# EasyEDA Pro project ax08.eprj, board debugger_x8
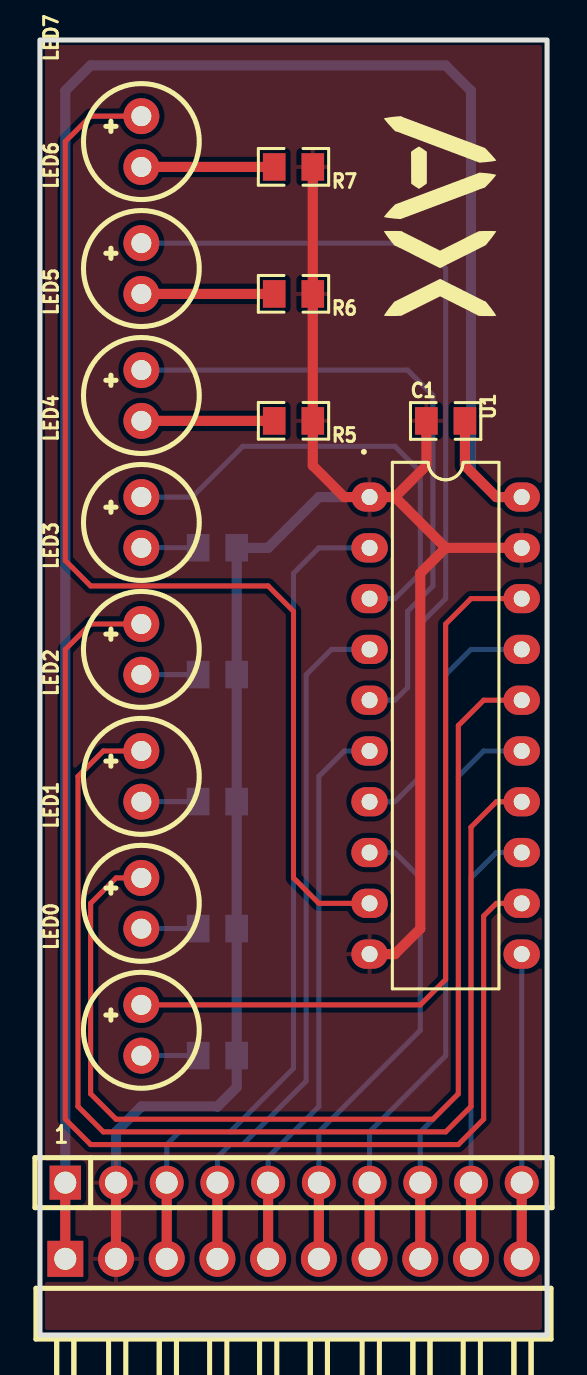
[diagram p39: board, top side]
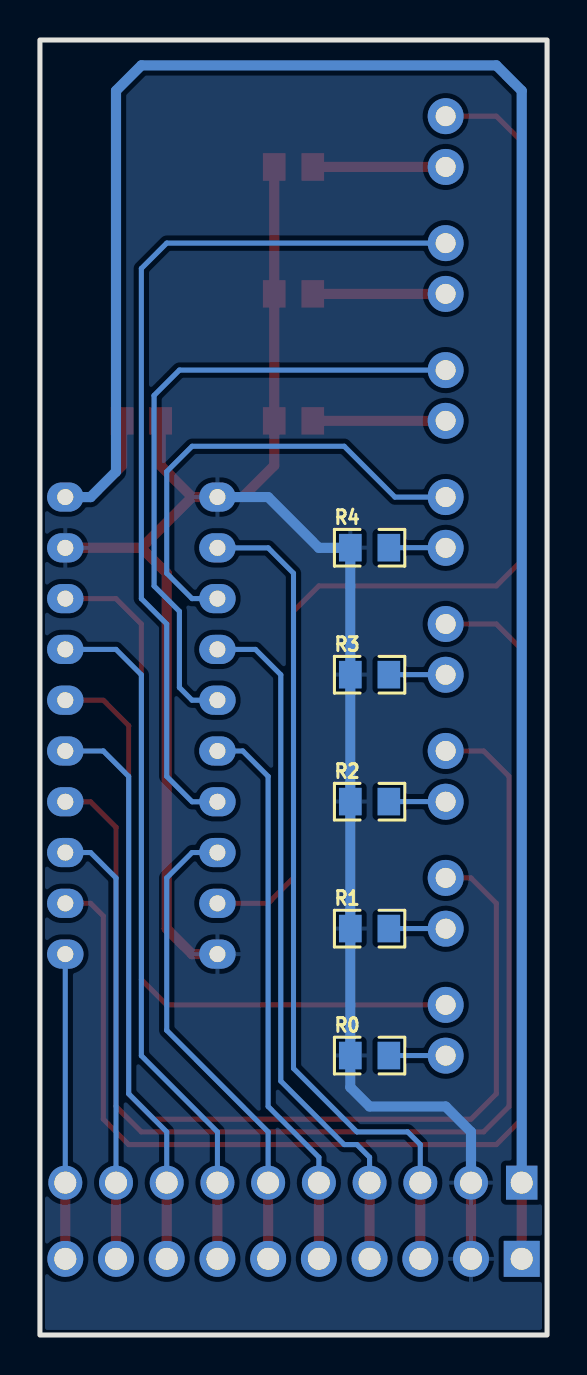
[diagram p40: board, bottom side, seen from below]

Outline 25.4 x 64.77 mm; copper layers: Top Layer, Bottom Layer. Coordinates in mm from the lower left corner of the outline.
Outline path: rectangle 0,64.77 25.4,0
Stack: Top Layer 0.035mm / Dielectric1 1.51mm FR4 er 4.5 / Bottom Layer 0.035mm

## Design rules (mm)
template: JLCPCB Capability(Two Layers Board)
spacing copperThickness1oz (default): track to track 0.102, other pairs 0.152 to 0.3
spacing copperThickness2oz: track to track 0.203, other pairs 0.152 to 0.3
track width copperThickness1oz (default): min 0.127, default 0.254, max 2.54
track width copperThickness2oz: min 0.203, default 0.254, max 2.54
differential pair differentialPair (default): width min 0.127, default 0.254, max 2.54; gap min 0.152, default 0.152
via viaSize (default): diameter min 0.5, default 0.61, max 10; hole min 0.3, default 0.305, max 6.3

## Placement (name value [footprint] x y rotation side)
C1  100nF  [R0805_1]  20.32 45.72 0 top
H1  PZ254R-11-10P  [HDR-TH_10P-P2.54-H-M-W10.4]  12.7 3.81 0 top
H2  PM254-1-10-Z-8.5  [HDR-TH_10P-P2.54-V-F]  12.7 7.62 0 top
LED0  DY-333SDRD-SN-A3(EL)(HF)  [LED-TH_BD5.9-P2.54-RD]  5.08 15.24 90 top
LED1  DY-333SDRD-SN-A3(EL)(HF)  [LED-TH_BD5.9-P2.54-RD]  5.08 21.59 90 top
LED2  DY-333SDRD-SN-A3(EL)(HF)  [LED-TH_BD5.9-P2.54-RD]  5.08 27.94 90 top
LED3  DY-333SDRD-SN-A3(EL)(HF)  [LED-TH_BD5.9-P2.54-RD]  5.08 34.29 90 top
LED4  DY-333SDRD-SN-A3(EL)(HF)  [LED-TH_BD5.9-P2.54-RD]  5.08 40.64 90 top
LED5  DY-333SDRD-SN-A3(EL)(HF)  [LED-TH_BD5.9-P2.54-RD]  5.08 46.99 90 top
LED6  DY-333SDRD-SN-A3(EL)(HF)  [LED-TH_BD5.9-P2.54-RD]  5.08 53.34 90 top
LED7  DY-333SDRD-SN-A3(EL)(HF)  [LED-TH_BD5.9-P2.54-RD]  5.08 59.69 90 top
R0  2K  [R0805_1]  8.89 13.98 180 bottom
R1  2K  [R0805_1]  8.89 20.33 180 bottom
R2  2K  [R0805_1]  8.89 26.68 180 bottom
R3  2K  [R0805_1]  8.89 33.03 180 bottom
R4  2K  [R0805_1]  8.89 39.38 180 bottom
R5  2K  [R0805_1]  12.7 45.72 180 top
R6  2K  [R0805_1]  12.7 52.07 180 top
R7  2K  [R0805_1]  12.7 58.42 180 top
U1  SN74LS244N(XBLW)  [PDIP-20_L26.2-W7.6-P2.54-LS7.9-BL]  20.32 30.48 270 top

## Footprints (pads in the part's own frame, mm; a bottom-side part is the same pattern mirrored in y, then rotated)
HDR-TH_10P-P2.54-H-M-W10.4
  rect 1.8x1.8 hole 1.1: 1(-11.43,0)
  round 1.8 hole 1.1: 2(-8.89,0) 3(-6.35,0) 4(-3.81,0) 5(-1.27,0) 6(1.27,0) 7(3.81,0) 8(6.35,0) 9(8.89,0) 10(11.43,0)
HDR-TH_10P-P2.54-V-F
  rect 1.575x1.7 hole 1.1: 1(-11.43,0)
  round 1.7 hole 1.1: 2(-8.89,0) 3(-6.35,0) 4(-3.81,0) 5(-1.27,0) 6(1.27,0) 7(3.81,0) 8(6.35,0) 9(8.89,0) 10(11.43,0)
LED-TH_BD5.9-P2.54-RD
  round 1.8 hole 1: 1(-1.27,0) 2(1.27,0)
PDIP-20_L26.2-W7.6-P2.54-LS7.9-BL
  oval 1.46x1.825 hole 0.8: 1(-11.43,-3.81) 2(-8.89,-3.81) 3(-6.35,-3.81) 4(-3.81,-3.81) 5(-1.27,-3.81) 6(1.27,-3.81) 7(3.81,-3.81) 8(6.35,-3.81) 9(8.89,-3.81) 10(11.43,-3.81) 11(11.43,3.81) 12(8.89,3.81) 13(6.35,3.81) 14(3.81,3.81) 15(1.27,3.81) 16(-1.27,3.81) 17(-3.81,3.81) 18(-6.35,3.81) 19(-8.89,3.81) 20(-11.43,3.81)
R0805_1
  rect 1.133x1.377 smd: 1(-0.966,0) 2(0.966,0)

## Nets
As in the schematic.

## Routing (per net, layer and track width the routed paths; a pad name or vN(x,y) marks a point on that pad's centre or on a via; arc(x,y) is an arc through that point)
+5V: length 107.6
  Top Layer w0.508: H1.1 H2.1 ; C1.2 21.29,43.48 22.86,41.91 U1.20
  Bottom Layer w0.508: U1.20 22.86,41.91 21.59,43.18 21.59,62.23 20.32,63.5 2.54,63.5 1.27,62.23 H2.1
GND: length 102.2
  Top Layer w0.508: H1.2 H2.2 ; U1.10 17.78,19.05 19.05,20.32 19.05,38.1 20.32,39.37 ; 20.32,39.37 U1.19 ; 20.32,39.37 17.78,41.91 ; R7.1 R6.1 R5.1 13.67,43.48 15.24,41.91 U1.1 17.78,41.91 ; 17.78,41.91 19.35,43.48 C1.1
  Bottom Layer w0.508: U1.1 13.97,41.91 11.43,39.37 9.86,39.37 R4.1 R3.1 R2.1 R1.1 R0.1 9.86,12.4 8.89,11.43 5.08,11.43 3.81,10.16 H2.2
$1N540: length 37.9
  Top Layer w0.254: LED0.2 19.05,16.51 20.32,17.78 20.32,35.56 21.59,36.83 U1.18
$1N546: length 54.2
  Top Layer w0.254: 5.08,22.86 3.81,22.86 2.54,21.59 2.54,12.07 3.81,10.8 19.69,10.8 20.95,12.07 20.95,30.48 22.22,31.75 U1.16
$1N552: length 58
  Top Layer w0.254: U1.14 22.86,26.67 21.59,25.4 21.59,11.43 20.32,10.16 3.17,10.16 1.91,11.43 1.91,27.94 3.17,29.21 5.08,29.21
$1N559: length 62.2
  Top Layer w0.254: U1.12 22.86,21.59 22.22,20.96 22.22,10.8 20.95,9.53 2.54,9.53 1.27,10.8 1.27,34.29 2.54,35.56 5.08,35.56
$1N569: length 23.7
  Bottom Layer w0.254: U1.3 17.78,36.83 19.05,38.1 19.05,43.18 17.78,44.45 10.16,44.45 7.62,41.91 LED4.2
$1N575: length 32.4
  Bottom Layer w0.254: LED5.2 18.41,48.26 19.69,46.99 19.69,37.47 18.41,36.2 18.41,32.39 17.78,31.75 U1.5
$1N582: length 44.8
  Bottom Layer w0.254: U1.7 17.78,26.67 19.05,27.94 19.05,35.56 20.32,36.83 20.32,53.34 19.05,54.61 LED6.2
$1N589: length 55.4
  Top Layer w0.254: LED7.2 2.54,60.96 1.27,59.69 1.27,38.74 2.54,37.47 11.43,37.47 12.7,36.2 12.7,22.86 13.97,21.59 U1.9
$1N789: length 2.8
  Bottom Layer w0.254: LED1.1 5.09,20.33 R1.2
$1N815: length 2.8
  Bottom Layer w0.254: R3.2 5.09,33.03 LED3.1
$1N841: length 2.8
  Bottom Layer w0.254: R4.2 5.09,39.38 LED4.1
$1N867: length 6.7
  Top Layer w0.508: R5.2 LED5.1
$1N893: length 6.7
  Top Layer w0.508: R6.2 LED6.1
$1N919: length 6.7
  Top Layer w0.508: LED7.1 R7.2
$1N945: length 2.8
  Bottom Layer w0.254: R0.2 5.09,13.98 LED0.1
$1N971: length 2.8
  Bottom Layer w0.254: R2.2 5.09,26.68 LED2.1
$1N1661: length 15.2
  Top Layer w0.508: H1.10 H2.10
  Bottom Layer w0.254: H2.10 U1.11
$1N1713: length 22.1
  Top Layer w0.508: H1.9 H2.9
  Bottom Layer w0.254: U1.13 22.86,24.13 21.59,22.86 H2.9
$1N1759: length 28.6
  Top Layer w0.508: H1.8 H2.8
  Bottom Layer w0.254: U1.15 22.22,29.21 20.95,27.94 20.95,12.07 19.05,10.16 H2.8
$1N1799: length 35.1
  Top Layer w0.508: H1.7 H2.7
  Bottom Layer w0.254: H2.7 16.51,10.16 20.32,13.97 20.32,33.02 21.59,34.29 U1.17
$1N1833: length 24.2
  Top Layer w0.508: H1.6 H2.6
  Bottom Layer w0.254: H2.6 13.97,10.16 19.05,15.24 19.05,22.86 17.78,24.13 U1.8
$1N1861: length 28.2
  Top Layer w0.508: H1.5 H2.5
  Bottom Layer w0.254: H2.5 11.43,8.89 13.97,11.43 13.97,27.94 15.24,29.21 U1.6
$1N1883: length 35.1
  Top Layer w0.508: H1.4 H2.4
  Bottom Layer w0.254: U1.4 14.6,34.29 13.33,33.02 13.33,12.7 10.16,9.53 9.52,9.53 8.89,8.89 H2.4
$1N1899: length 42.7
  Top Layer w0.508: H1.3 H2.3
  Bottom Layer w0.254: H2.3 6.35,9.53 6.98,10.16 9.52,10.16 12.7,13.34 12.7,38.1 13.97,39.37 U1.2

## Copper pours and planes (outline as drawn; the poured copper is in the pictures)
GND on Top Layer: 0,64.77 25.4,64.77 25.4,0 0,0
GND on Bottom Layer: 0,64.77 25.4,64.77 25.4,0 0,0

## Text on the board
Top Silkscreen Layer: 1
